# EAGLE design powersupply (EAGLE 5.10)
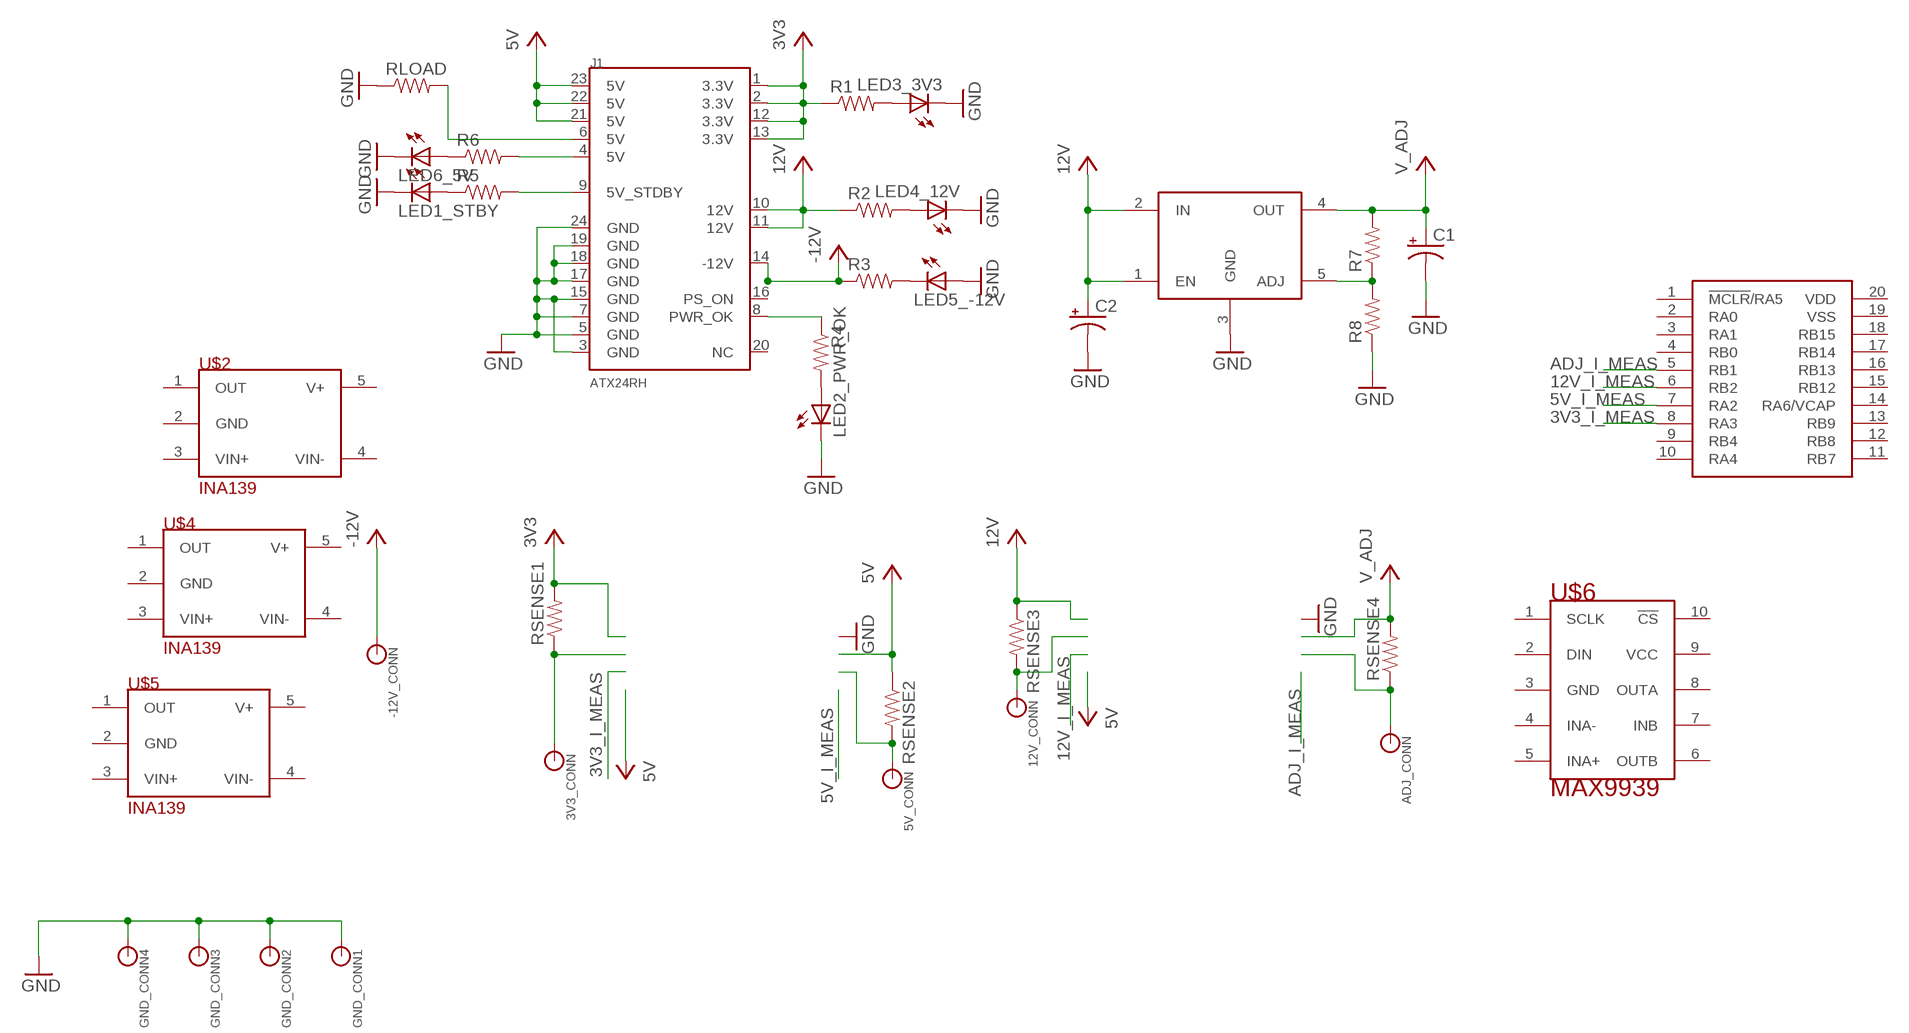
[diagram p0: schematic, sheet 1]

## Parts
3V3_CONN  BANANA_CONNELECTRICAL  [BANANA_CON_ELECT]
5V_CONN  BANANA_CONNELECTRICAL  [BANANA_CON_ELECT]
12V_CONN  BANANA_CONNELECTRICAL  [BANANA_CON_ELECT]
-12V_CONN  BANANA_CONNELECTRICAL  [BANANA_CON_ELECT]
ADJ_CONN  BANANA_CONNELECTRICAL  [BANANA_CON_ELECT]
C1  CAP_POLPTH2  [CPOL-RADIAL-10UF-25V]
C2  CAP_POLPTH2  [CPOL-RADIAL-10UF-25V]
GND_CONN1  BANANA_CONNELECTRICAL  [BANANA_CON_ELECT]
GND_CONN2  BANANA_CONNELECTRICAL  [BANANA_CON_ELECT]
GND_CONN3  BANANA_CONNELECTRICAL  [BANANA_CON_ELECT]
GND_CONN4  BANANA_CONNELECTRICAL  [BANANA_CON_ELECT]
J1  ATX24RH  [ATX24_RIGHT_ANGLE]
LED1_STBY  LED5MM  [LED5MM]
LED2_PWR_OK  LED5MM  [LED5MM]
LED3_3V3  LED5MM  [LED5MM]
LED4_12V  LED5MM  [LED5MM]
LED5_-12V  LED5MM  [LED5MM]
LED6_5V  LED5MM  [LED5MM]
R1  RESISTORPTH1  [AXIAL-0.3]
R2  RESISTORPTH1  [AXIAL-0.3]
R3  RESISTORPTH1  [AXIAL-0.3]
R4  RESISTORPTH1  [AXIAL-0.3]
R5  RESISTORPTH1  [AXIAL-0.3]
R6  RESISTORPTH1  [AXIAL-0.3]
R7  RESISTORPTH1  [AXIAL-0.3]
R8  RESISTORPTH1  [AXIAL-0.3]
RLOAD  RESISTORPTH1  [AXIAL-0.3]
RSENSE1  RESISTORPTH1  [AXIAL-0.3]
RSENSE2  RESISTORPTH1  [AXIAL-0.3]
RSENSE3  RESISTORPTH1  [AXIAL-0.3]
RSENSE4  RESISTORPTH1  [AXIAL-0.3]
U$1  MIC29502WT  [TO220-5]
U$2  INA139  [SOT23-5L]
U$3  PIC24F16KA301  [DIL20]
U$4  INA139  [SOT23-5L]
U$5  INA139  [SOT23-5L]
U$6  MAX9939  [UMAX10]

## Nets
3V3: J1.1(3.3V) J1.2(3.3V) J1.12(3.3V) J1.13(3.3V) R1.P$1 RSENSE1.P$2
3V3_I_MEAS: U$3.8(RA3)
5V: J1.21(5V) J1.22(5V) J1.23(5V) RSENSE2.P$1
5V_I_MEAS: U$3.7(RA2)
5V_IND: J1.4(5V) R6.P$2
5V_LOAD: J1.6(5V) RLOAD.P$2
12V: C2.1(+) J1.10(12V) J1.11(12V) R2.P$1 RSENSE3.P$1 U$1.1(EN) U$1.2(IN)
12V_I_MEAS: U$3.6(RB2)
-12V: -12V_CONN.P$1 J1.14(-12V) R3.P$1
ADJ_I_MEAS: U$3.5(RB1)
GND: C1.2(-) C2.2(-) GND_CONN1.P$1 GND_CONN2.P$1 GND_CONN3.P$1 GND_CONN4.P$1 J1.3(GND) J1.5(GND) J1.7(GND) J1.15(GND) J1.17(GND) J1.18(GND) J1.19(GND) J1.24(GND) LED1_STBY.K(C) LED2_PWR_OK.K(C) LED3_3V3.K(C) LED4_12V.K(C) LED5_-12V.A LED6_5V.K(C) R8.P$1 RLOAD.P$1 U$1.3(GND)
N$1: LED3_3V3.A R1.P$2
N$2: LED4_12V.A R2.P$2
N$3: LED5_-12V.K(C) R3.P$2
N$4: LED2_PWR_OK.A R4.P$2
N$5: LED1_STBY.A R5.P$1
N$6: LED6_5V.A R6.P$1
N$8: 3V3_CONN.P$1 RSENSE1.P$1
N$10: 5V_CONN.P$1 RSENSE2.P$2
N$11: 12V_CONN.P$1 RSENSE3.P$2
N$14: ADJ_CONN.P$1 RSENSE4.P$1
N$15: R7.P$1 R8.P$2 U$1.5(ADJ)
PWR_OK_IND: J1.8(PWR_OK) R4.P$1
STDBY_IND: J1.9(5V_STDBY) R5.P$2
V_ADJ: C1.1(+) R7.P$2 RSENSE4.P$2 U$1.4(OUT)
Unconnected: J1.16(PS_ON) J1.20(NC) U$2.1(OUT) U$2.2(GND) U$2.3(VIN+) U$2.4(VIN-) U$2.5(V+) U$3.1(!MCLR!/RA5) U$3.2(RA0) U$3.3(RA1) U$3.4(RB0) U$3.9(RB4) U$3.10(RA4) U$3.11(RB7) U$3.12(RB8) U$3.13(RB9) U$3.14(RA6/VCAP) U$3.15(RB12) U$3.16(RB13) U$3.17(RB14) U$3.18(RB15) U$3.19(VSS) U$3.20(VDD) U$4.1(OUT) U$4.2(GND) U$4.3(VIN+) U$4.4(VIN-) U$4.5(V+) U$5.1(OUT) U$5.2(GND) U$5.3(VIN+) U$5.4(VIN-) U$5.5(V+) U$6.1(SCLK) U$6.2(DIN) U$6.3(GND) U$6.4(INA-) U$6.5(INA+) U$6.6(OUTB) U$6.7(INB) U$6.8(OUTA) U$6.9(VCC) U$6.10(!CS!)

## Library data of the parts
3V3_CONN 5V_CONN 12V_CONN -12V_CONN ADJ_CONN GND_CONN1-GND_CONN4 = ideabot:BANANA_CONN
C1 C2 = SparkFun:CAP_POL: Capacitor Polarized These are standard SMD and PTH capacitors. Normally 10uF, 47uF, and 100uF in electrolytic and tantalum varieties. Always verify the external diameter of the through hole cap, it varies with capacity, voltage, and manufacturer. The EIA devices should be standard.
J1 = SparkFun:ATX24
LED1_STBY LED2_PWR_OK LED3_3V3 LED4_12V LED5_-12V LED6_5V = SparkFun:LED: LEDs Standard schematic elements and footprints for 5mm, 3mm, 1206, and 0603 sized LEDs. 5mm - Spark Fun Electronics SKU : COM-00529 (and others)
R1-R8 RLOAD RSENSE1-RSENSE4 = SparkFun:RESISTOR: Resistor Basic schematic elements and footprints for 0603, 1206, and PTH 1/10th watt (small) resistors.
U$1 = ideabot:MIC29502WT
U$2 U$4 U$5 = ideabot:INA139
U$3 = ideabot:PIC24F16KA301
U$6 = ideabot:MAX9939

## Board
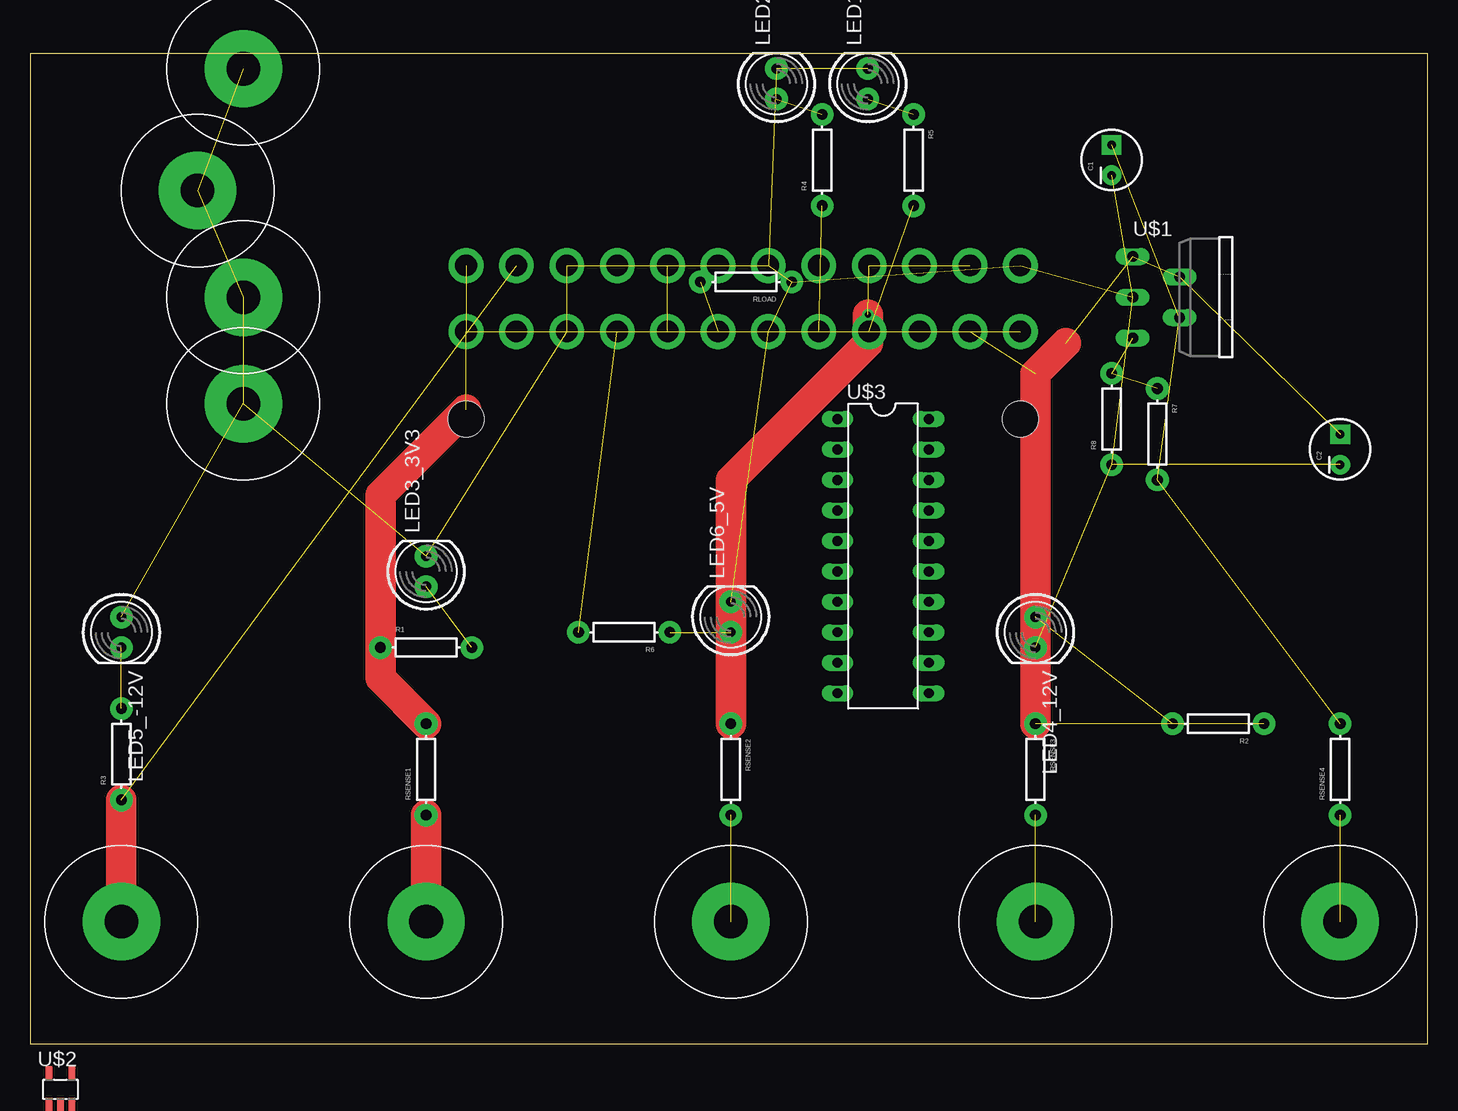
[diagram p1: board, top side]
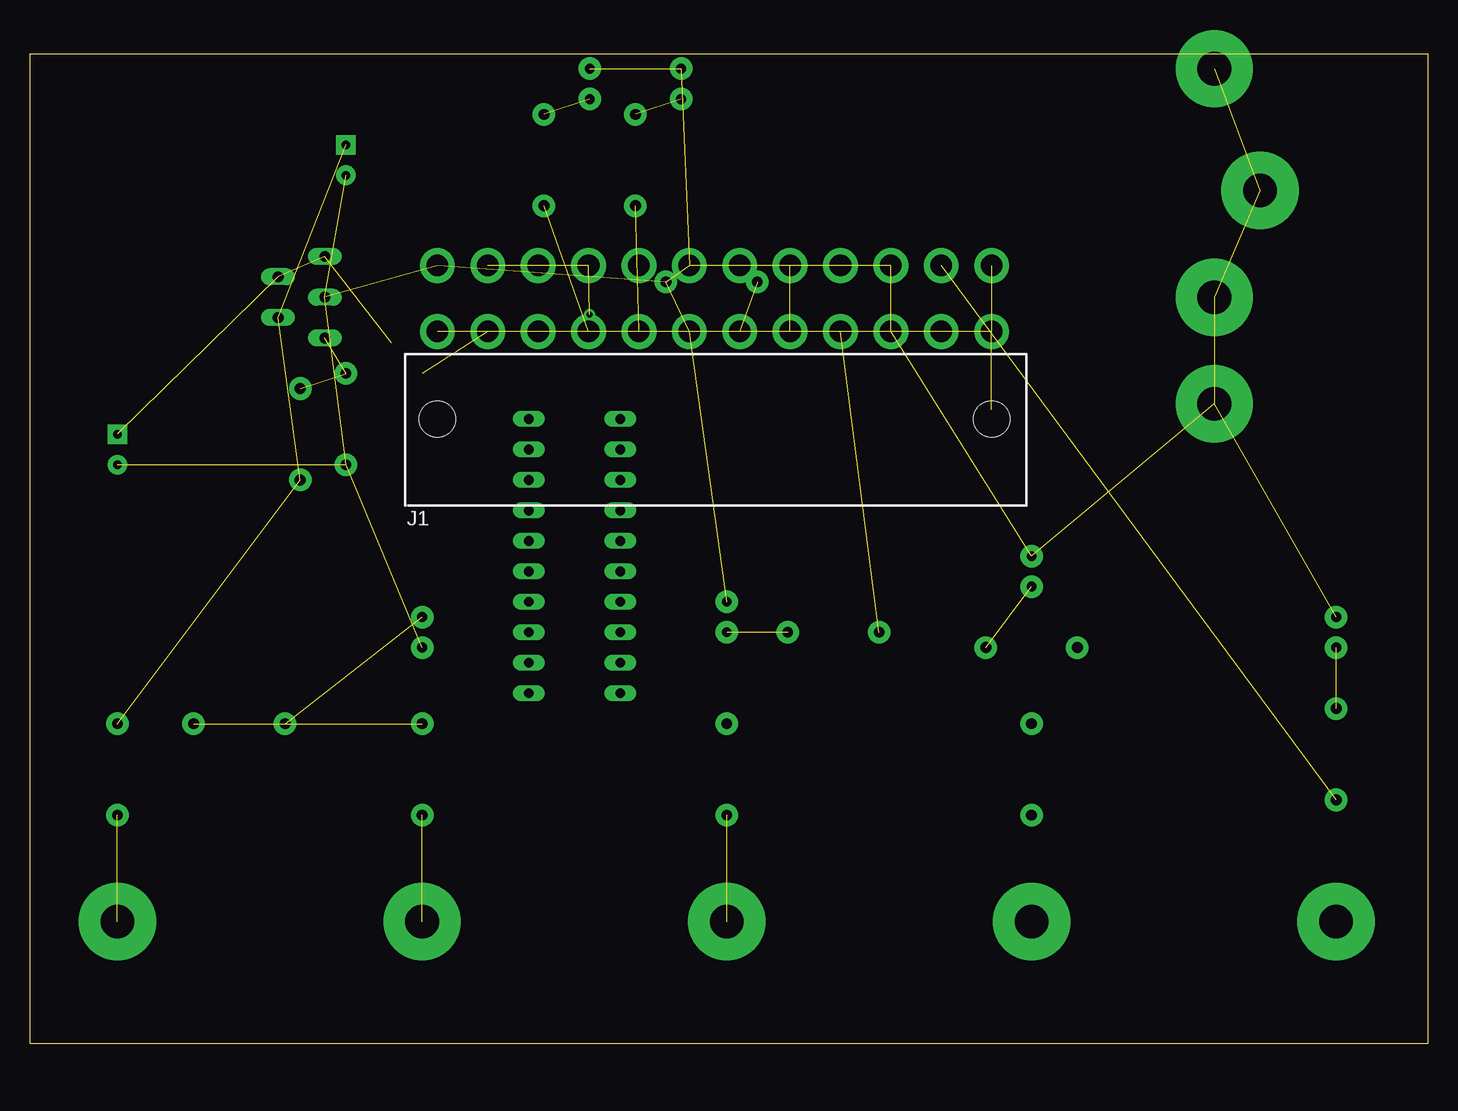
[diagram p2: board, bottom side, seen from below]

Size 116.51 x 82.54 mm. Coordinates in mm from the lower left corner, seen from the top.
Outline: 0,0 116.51,0 116.51,82.54 0,82.54 0,0
Copper layers (1*16): Top 0.035mm / dielectric 1.5mm / Bottom 0.035mm
Design rules "default": minimum track width 10mil, minimum drill 24mil, track to track 8mil, track to pad 8mil, pad to pad 8mil, via to via 8mil, smd to smd 8mil, copper to edge 40mil, drill to drill 8mil, minimum pad ring 10mil, minimum via ring 8mil, stop-mask expansion 4mil, vias tented up to drill 0mil, thermal gap 10mil

### Footprints (pad centres in the part's own frame; a part is rotated, then mirrored left to right if it is on the bottom)
BANANA_CON_ELECT = drill 2.8 pad 6.452 round: P$1 0,0
CPOL-RADIAL-10UF-25V = drill 0.7 pad 1.651 square: 1 1.27,0 | drill 0.7 pad 1.651 round: 2 -1.27,0
ATX24_RIGHT_ANGLE = drill 1.8 pad 2.9 round: 1 23.34,4.76; 2 19.14,4.76; 3 14.94,4.76; 4 10.74,4.76; 5 6.54,4.76; 6 2.34,4.76; 7 -1.86,4.76; 8 -6.06,4.76; 9 -10.26,4.76; 10 -14.46,4.76; 11 -18.66,4.76; 12 -22.86,4.76; 13 23.34,10.26; 14 19.14,10.26; 15 14.94,10.26; 16 10.74,10.26; 17 6.54,10.26; 18 2.34,10.26; 19 -1.86,10.26; 20 -6.06,10.26; 21 -10.26,10.26; 22 -14.46,10.26; 23 -18.66,10.26; 24 -22.86,10.26 | hole 3: -22.86,-2.54; 23.34,-2.54
LED5MM = drill 0.813 pad 1.88 round: A -1.27,0; K 1.27,0
AXIAL-0.3 = drill 0.9 pad 1.88 round: P$1 -3.81,0; P$2 3.81,0
TO220-5 = drill 0.9 long: 1 -3.4,-8.4; 2 -1.7,-4.5; 3 0,-8.4; 4 1.7,-4.5; 5 3.4,-8.4
SOT23-5L = smd 0.55 x 1.2: 1 -0.95,-1.3; 2 0,-1.3; 3 0.95,-1.3; 4 0.95,1.3; 5 -0.95,1.3
DIL20 = drill 0.813 long: 1 -11.43,-3.81; 2 -8.89,-3.81; 3 -6.35,-3.81; 4 -3.81,-3.81; 5 -1.27,-3.81; 6 1.27,-3.81; 7 3.81,-3.81; 8 6.35,-3.81; 9 8.89,-3.81; 10 11.43,-3.81; 11 11.43,3.81; 12 8.89,3.81; 13 6.35,3.81; 14 3.81,3.81; 15 1.27,3.81; 16 -1.27,3.81; 17 -3.81,3.81; 18 -6.35,3.81; 19 -8.89,3.81; 20 -11.43,3.81
UMAX10 = smd 0.32 x 0.9: 1 -1,-2.25; 2 -0.5,-2.25; 3 0,-2.25; 4 0.5,-2.25; 5 1,-2.25; 6 1,2.25; 7 0.5,2.25; 8 0,2.25; 9 -0.5,2.25; 10 -1,2.25

### Placement (x,y rotation side)
3V3_CONN  33.02,10.16 0 top
5V_CONN  58.42,10.16 0 top
12V_CONN  83.82,10.16 0 top
-12V_CONN  7.62,10.16 0 top
ADJ_CONN  109.22,10.16 0 top
C1  90.17,73.66 90 top
C2  109.22,49.53 90 top
GND_CONN1  17.78,53.34 0 top
GND_CONN2  17.78,62.23 0 top
GND_CONN3  13.97,71.12 0 top
GND_CONN4  17.78,81.28 0 top
J1  59.69,54.61 0 bottom
LED1_STBY  69.85,80.01 90 top
LED2_PWR_OK  62.23,80.01 90 top
LED3_3V3  33.02,39.37 90 top
LED4_12V  83.82,34.29 270 top
LED5_-12V  7.62,34.29 270 top
LED6_5V  58.42,35.56 90 top
R1  33.02,33.02 0 top
R2  99.06,26.67 180 top
R3  7.62,24.13 90 top
R4  66.04,73.66 90 top
R5  73.66,73.66 270 top
R6  49.53,34.29 180 top
R7  93.98,50.8 270 top
R8  90.17,52.07 90 top
RLOAD  59.69,63.5 180 top
RSENSE1  33.02,22.86 90 top
RSENSE2  58.42,22.86 270 top
RSENSE3  83.82,22.86 270 top
RSENSE4  109.22,22.86 90 top
U$1  100.33,62.23 270 top
U$2  2.54,-3.81 0 top
U$3  71.12,40.64 270 top
U$4  2.54,-12.7 0 top  (outside the outline)
U$5  2.54,-21.59 0 top  (outside the outline)
U$6  -3.81,-22.86 0 top  (outside the outline)

### Tracks (layer width: path | path; a pad name or v marks a point on that pad's centre or on a via)
3V3  (via drill 0.51)  (4 unrouted)
  Top 2.54: v36.35,52.86 29.21,45.72 R1.P$1 29.21,30.48 RSENSE1.P$2
5V  (via drill 0.51)  (3 unrouted)
  Top 2.54: RSENSE2.P$1 58.42,46.99 69.85,58.42 v69.85,60.76
5V_IND  (1 unrouted)
5V_LOAD  (1 unrouted)
12V  (6 unrouted)
  Top 2.54: RSENSE3.P$1 83.82,55.88 86.36,58.42
-12V  (1 unrouted)
  Top 2.54: -12V_CONN.P$1 R3.P$1
GND  (22 unrouted)
N$1  (1 unrouted)
N$2  (1 unrouted)
N$3  (1 unrouted)
N$4  (1 unrouted)
N$5  (1 unrouted)
N$6  (1 unrouted)
N$8
  Top 2.54: 3V3_CONN.P$1 RSENSE1.P$1
N$10  (1 unrouted)
N$11  (1 unrouted)
N$14  (1 unrouted)
N$15  (2 unrouted)
PWR_OK_IND  (1 unrouted)
STDBY_IND  (1 unrouted)
V_ADJ  (3 unrouted)